# Altium schematic sheet Peripherials.SchDoc
size A4; SheetNumber: 2; SheetTotal: 7
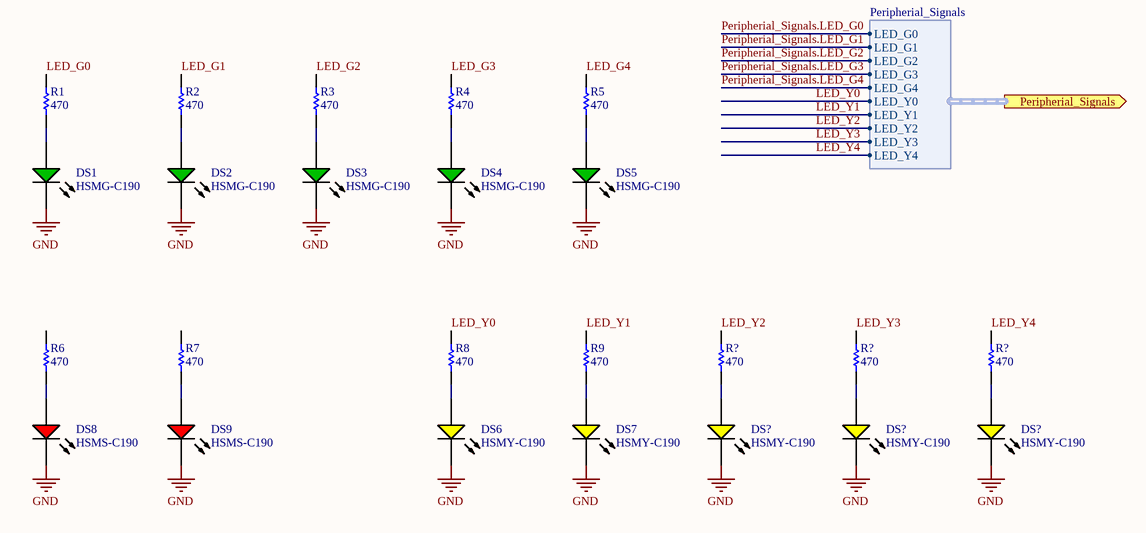
[diagram p0: Peripherials.SchDoc]

## Parts
(Parts that share a designator on the sheet are numbered #1, #2 ... from top to bottom, then left to right.)
DS1  HSMG-C190  [AVAG-HSMX-C190_V]
DS2  HSMG-C190  [AVAG-HSMX-C190_V]
DS3  HSMG-C190  [AVAG-HSMX-C190_V]
DS4  HSMG-C190  [AVAG-HSMX-C190_V]
DS5  HSMG-C190  [AVAG-HSMX-C190_V]
DS6  HSMY-C190  [AVAG-HSMX-C190_V]
DS7  HSMY-C190  [AVAG-HSMX-C190_V]
DS8  HSMS-C190  [AVAG-HSMX-C190_V]
DS9  HSMS-C190  [AVAG-HSMX-C190_V]
DS?#1  HSMY-C190  [AVAG-HSMX-C190_V]
DS?#2  HSMY-C190  [AVAG-HSMX-C190_V]
DS?#3  HSMY-C190  [AVAG-HSMX-C190_V]
R1  470  [RESC1608X55X30ML15T15]
R2  470  [RESC1608X55X30ML15T15]
R3  470  [RESC1608X55X30ML15T15]
R4  470  [RESC1608X55X30ML15T15]
R5  470  [RESC1608X55X30ML15T15]
R6  470  [RESC1608X55X30ML15T15]
R7  470  [RESC1608X55X30ML15T15]
R8  470  [RESC1608X55X30ML15T15]
R9  470  [RESC1608X55X30ML15T15]
R?#1  470  [RESC1608X55X30ML15T15]
R?#2  470  [RESC1608X55X30ML15T15]
R?#3  470  [RESC1608X55X30ML15T15]

## Ports
Peripherial_Signals (out, harness Peripherial_Signals)

## Harnesses
Peripherial_Signals: LED_G0, LED_G1, LED_G2, LED_G3, LED_G4, LED_Y0, LED_Y1, LED_Y2, LED_Y3, LED_Y4

## Nets
GND: DS1.2(K) DS2.2(K) DS3.2(K) DS4.2(K) DS5.2(K) DS6.2(K) DS7.2(K) DS8.2(K) DS9.2(K) DS?#1.2(K) DS?#2.2(K) DS?#3.2(K)
LED_G0: R1.2
LED_G1: R2.2
LED_G2: R3.2
LED_G3: R4.2
LED_G4: R5.2
LED_Y0: R8.2 ; port Peripherial_Signals.LED_Y0
LED_Y1: R9.2 ; port Peripherial_Signals.LED_Y1
LED_Y2: R?#1.2 ; port Peripherial_Signals.LED_Y2
LED_Y3: R?#2.2 ; port Peripherial_Signals.LED_Y3
LED_Y4: R?#3.2 ; port Peripherial_Signals.LED_Y4
Peripherial_Signals.LED_G0: port Peripherial_Signals.LED_G0
Peripherial_Signals.LED_G1: port Peripherial_Signals.LED_G1
Peripherial_Signals.LED_G2: port Peripherial_Signals.LED_G2
Peripherial_Signals.LED_G3: port Peripherial_Signals.LED_G3
Peripherial_Signals.LED_G4: port Peripherial_Signals.LED_G4
NetDS1_1: DS1.1(A) R1.1
NetDS2_1: DS2.1(A) R2.1
NetDS3_1: DS3.1(A) R3.1
NetDS4_1: DS4.1(A) R4.1
NetDS5_1: DS5.1(A) R5.1
NetDS6_1: DS6.1(A) R8.1
NetDS7_1: DS7.1(A) R9.1
NetDS8_1: DS8.1(A) R6.1
NetDS9_1: DS9.1(A) R7.1
NetDS?#1_1: DS?#1.1(A) R?#1.1
NetDS?#2_1: DS?#2.1(A) R?#2.1
NetDS?#3_1: DS?#3.1(A) R?#3.1

Not connected (* = marked no-connect by the designer): R6 2; R7 2

## Library data of the parts
DS1-DS5 = CMP-1744-00002-1: Chip LED, Green, 2.2 V, -40 to 85 degC, 2-Pin SMD, RoHS, Tape and Reel; Frequency: 400 KHz; Max Supply Voltage: 5.5 V; Access Time: 3500 ns; Clock Frequency: 100 KHz; Case\Package: SOIC; Density: 32 kb; Nominal Supply Current: 2 mA; Interface: Serial; Min Supply Voltage: 1.7 V; Packaging: Tape and Reel; PackageReference: HSMX-C190; ComponentLink2URL: http://docs.avagotech.com/docs/AV02-0551EN; RoHSCompliant: true; Pins: 8; REACH SVHC: No SVHC; Max Operating Temperature: 85 degC; Width: 4 mm; Radiation Hardening: No; Package Quantity: 3000; ComponentLink3Description: Package Specification; ComponentLink1Description: Manufacturer URL; Min Operating Temperature: -40 degC; PackageDescription: 2-Pin Surface Mount Device, Body 1.6 x 0.8 mm, Height 0.9 mm; Max Clock Frequency: 100 KHz; Height: 1.5 mm; ComponentLink1URL: http://www.avagotech.com/; DatasheetVersion: Mar-12; ComponentLink2Description: Datasheet; Mount: Surface Mount; Length: 5 mm; ComponentLink3URL: http://www.fairchildsemi.com/dwg/MA/MA03D.pdf
DS6 DS7 DS?#1-DS?#3 = CMP-1744-00003-1: LED Uni-Color Yellow, 65 mW, 20 mA, -40 to 85 degC, 2-Pin SMD, RoHS, Tape and Reel; Tolerance: 1%; Voltage Rating: 50 V; Power Rating: 100 mW; Case\Package: 0603; Resistance: 390 Ohm; Min Operating Temperature: -55 degC; Length: 1.6 mm; ComponentLink3Description: Package Specification; Mount: Surface Mount; PackageReference: HSMX-C190; ComponentLink2Description: Datasheet; DatasheetVersion: Mar-12; Case Code (Metric): 1608; Pins: 2; Package Quantity: 5000; ComponentLink2URL: http://docs.avagotech.com/docs/AV02-0551EN; ComponentLink1Description: Manufacturer URL; RoHSCompliant: true; Packaging: Tape and Reel; PackageDescription: 2-Pin Surface Mount Device, Body 1.6 x 0.8 mm, Height 0.9 mm; REACH SVHC: No SVHC; ComponentLink3URL: http://www.fairchildsemi.com/dwg/MA/MA03D.pdf; Voltage Rating (DC): 50 V; Width: 0.8 mm; ComponentLink1URL: http://www.avagotech.com/; Max Operating Temperature: 155 degC; Case Code (Imperial): 0603; Height: 0.45 mm
DS8 DS9 = CMP-2000-06427-1: LED Uni-Color Red, 52 mW, 20 mA, -40 to 85 degC, 2-Pin SMD, RoHS, Tape and Reel; Manufacturer: Avago; Reverse Voltage: 5V; Viewing Angle: 170deg; High Brightness: No; Lens Type: ColorlessDiffused; DELETED: Compliant; Product Height (mm): 0.8mm; Dominant Wave Length: 626nm; Number of  Elements: 1; Chip Material: GaP; Lum Intensity: 10mcd; Product Length (mm): 1.6mm; Forward Voltage: 2.6V; Power Dissipation: 52W; Shape Type: Rectangular; Forward Current: 25mA; Peak Wavelength: 630nm; Test Current (It): 20mA; Main Category: ChipLED; Lens Dimensions: 1x0.8x0.5mm; Pin Count: 2; Package Reference: HSMX-C190; Mounting Technology: SurfaceMount; Mounting: SurfaceMount; Datasheet URL: http://docs.avagotech.com/docs/AV02-0551EN; Package Type: ChipLed; Operating Temperature Classification: Industrial; Datasheet Version: 03/2012; Operating Temp Range: -40Cto85C; Emitting Color: Red; Rad Hardened: No; Manufacturer URL: http://www.avagotech.com/; Luminous Intensity: 10mcd; Package Description: 2-Pin Surface Mount Device, Body 1.6 x 0.8 mm, Height 0.9 mm; Type: Uni-Color; Packaging: TapeandReel; Product Depth (mm): 0.8mm
R1-R9 R?#1-R?#3 = CMP-1012-00473-6: Chip Resistor, 470 Ohm, +/- 1%, 0.1 W, -55 to 155 degC, 0603 (1608 Metric), RoHS, Tape and Reel; Manufacturer: Panasonic; Voltage Rating: 75 V; Height: 0.45 mm; ComponentLink1Description: Manufacturer URL; Packaging: Tape and Reel; Max Operating Temperature: 155 degC; ComponentLink3Description: Package Specification; ComponentLink3URL: https://datasheet.ciiva.com/11808/0900766b80f806dd-11808207.pdf; ComponentLink2Description: Datasheet; RoHSCompliant: true; ComponentLink1URL: http://www.panasonic.com/; Min Operating Temperature: -55 degC; PackageReference: 0603; DatasheetVersion: 04/2015; REACH SVHC: Yes; Length: 1.6 mm; Mount: Surface Mount; Mounting Technology: Surface Mount; Pins: 2; ComponentLink2URL: http://industrial.panasonic.com/cdbs/www-data/pdf/RDA0000/AOA0000C86.pdf; PackageDescription: 2-Pin Surface Mount Device, Body 1.6 x 0.85 mm; Package Quantity: 1